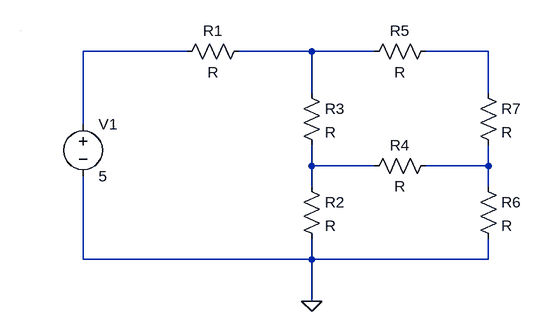
[diagram p0: schematic Lab3.asc]
Lab3.asc, the LTspice schematic file:
Version 4
SHEET 1 880 680
WIRE 256 32 96 32
WIRE 448 32 336 32
WIRE 544 32 448 32
WIRE 720 32 624 32
WIRE 448 96 448 32
WIRE 720 96 720 32
WIRE 96 144 96 32
WIRE 448 208 448 176
WIRE 544 208 448 208
WIRE 720 208 720 176
WIRE 720 208 624 208
WIRE 448 240 448 208
WIRE 720 240 720 208
WIRE 96 352 96 224
WIRE 448 352 448 320
WIRE 448 352 96 352
WIRE 720 352 720 320
WIRE 720 352 448 352
WIRE 448 416 448 352
WIRE 0 0 0 0
FLAG 448 416 0
SYMBOL voltage 96 128 R0
WINDOW 123 0 0 Left 2
WINDOW 39 0 0 Left 2
SYMATTR InstName V1
SYMATTR Value 5
SYMBOL res 352 16 R90
WINDOW 0 0 56 VBottom 2
WINDOW 3 32 56 VTop 2
SYMATTR InstName R1
SYMBOL res 432 224 R0
SYMATTR InstName R2
SYMBOL res 432 80 R0
SYMATTR InstName R3
SYMBOL res 640 192 R90
WINDOW 0 0 56 VBottom 2
WINDOW 3 32 56 VTop 2
SYMATTR InstName R4
SYMBOL res 640 16 R90
WINDOW 0 0 56 VBottom 2
WINDOW 3 32 56 VTop 2
SYMATTR InstName R5
SYMBOL res 704 224 R0
SYMATTR InstName R6
SYMBOL res 704 80 R0
SYMATTR InstName R7

The netlist it stands for:
* Lab3.asc
V1 N001 0 5
R1 N002 N001 R
R2 N004 0 R
R3 N002 N004 R
R4 N005 N004 R
R5 N003 N002 R
R6 N005 0 R
R7 N003 N005 R
.backanno
.end